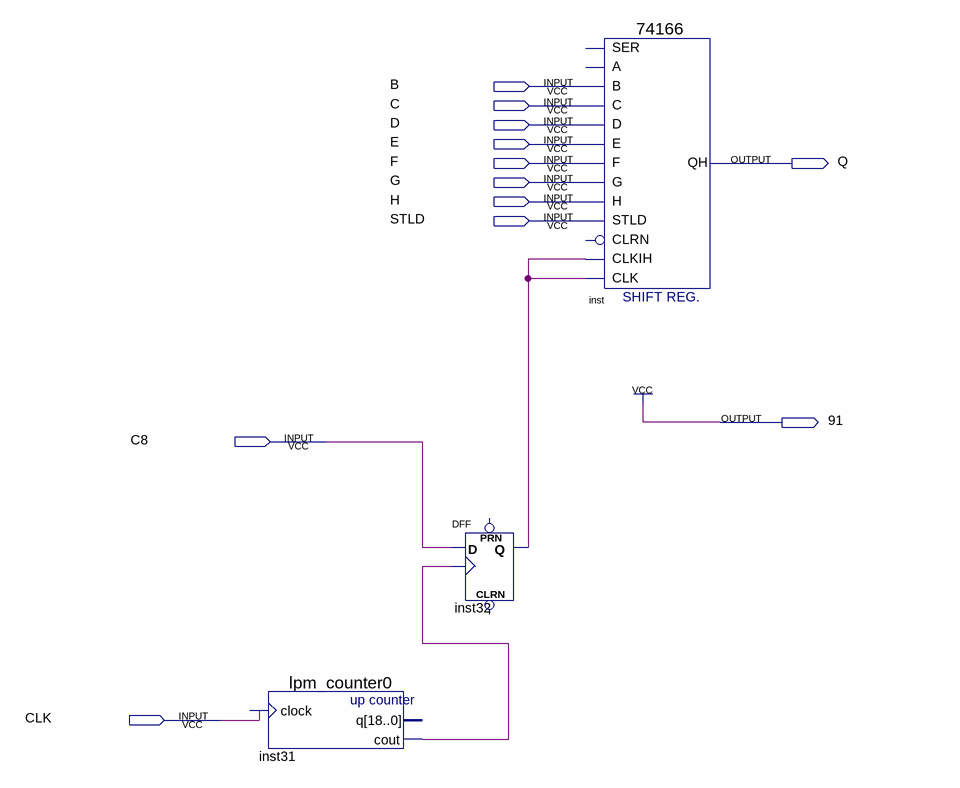
[diagram p0: schematic sheet]
// Quartus schematic Registers2.bdf as structural Verilog: 3 symbols, 12 pins
module Registers2 (
  input  B,
  input  C,
  input  D,
  input  E,
  input  F,
  input  G,
  input  H,
  input  STLD,
  input  C8,
  input  CLK,
  output Q,
  output \91 
);

  wire inst31_cout, inst32_q;

  lpm_counter0 inst31 (.clock(CLK), .cout(inst31_cout));  // open: q
  DFF inst32 (.CLK(inst31_cout), .D(C8), .Q(inst32_q));  // open: CLRN, PRN
  \74166  inst (
    .C(C), .D(D), .E(E), .B(B), .STLD(STLD), .H(H), .G(G), .F(F), .CLK(inst32_q), .CLKIH(inst32_q), .QH(Q));  // open: SER, A, CLRN

  assign \91  = 1'b1;
endmodule
